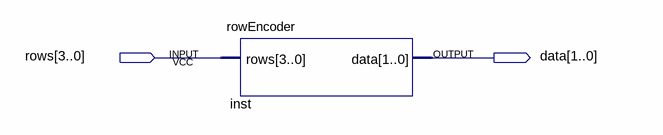
[diagram p0: schematic sheet]
// Quartus schematic testrowencoder.bdf as structural Verilog: 1 symbols, 2 pins
module testrowencoder (
  input  [3:0] rows,
  output [1:0] data
);

  rowEncoder inst (.rows(rows), .data(data));
endmodule
